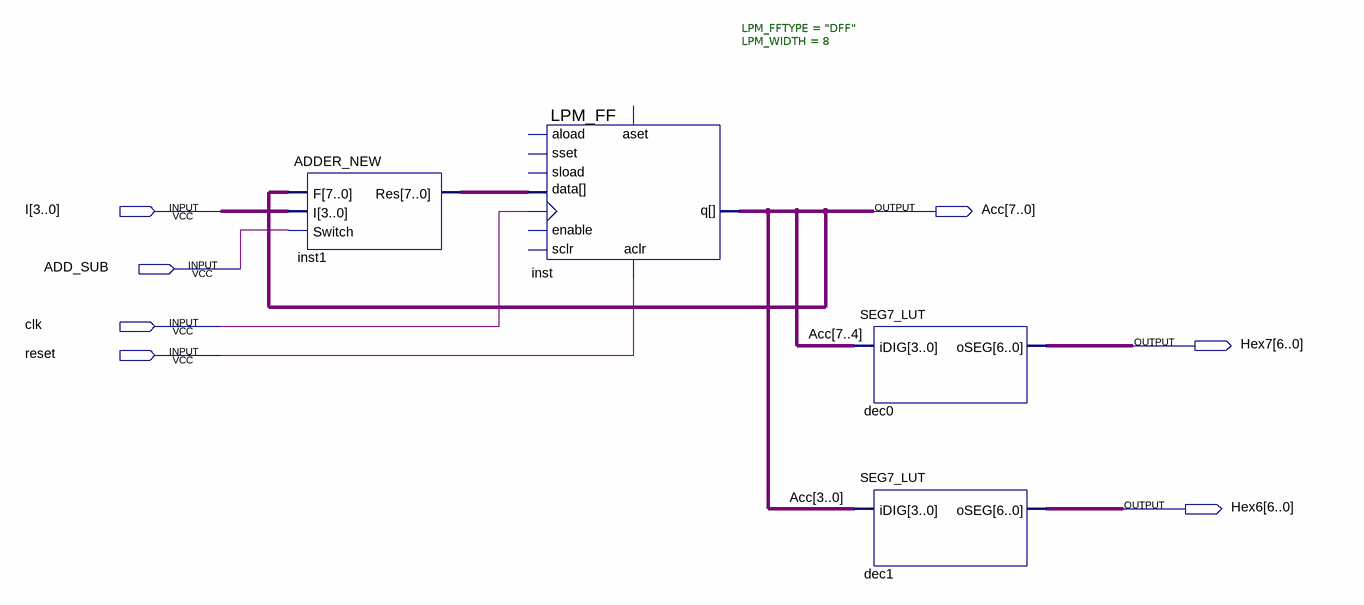
[diagram p0: schematic sheet]
// Quartus schematic AccumulatorFINAL.bdf as structural Verilog: 4 symbols, 7 pins
module AccumulatorFINAL (
  input  [3:0] I,
  input  ADD_SUB,
  input  clk,
  input  reset,
  output [7:0] Acc,
  output [6:0] Hex7,
  output [6:0] Hex6
);

  wire [7:0] inst1_res;

  ADDER_NEW inst1 (.F(Acc), .I(I), .Switch(ADD_SUB), .Res(inst1_res));
  LPM_FF #(.LPM_FFTYPE("DFF"), .LPM_WIDTH(8)) inst (
    .clock(clk), .aclr(reset), .data(inst1_res), .q(Acc));  // open: enable, aload, sset, sload, aset, sclr
  SEG7_LUT dec0 (.iDIG(Acc[7:4]), .oSEG(Hex7));
  SEG7_LUT dec1 (.iDIG(Acc[3:0]), .oSEG(Hex6));
endmodule
